# Altium schematic sheet FPGA Board Top.SchDoc
size C; SheetNumber: 1; SheetTotal: 5
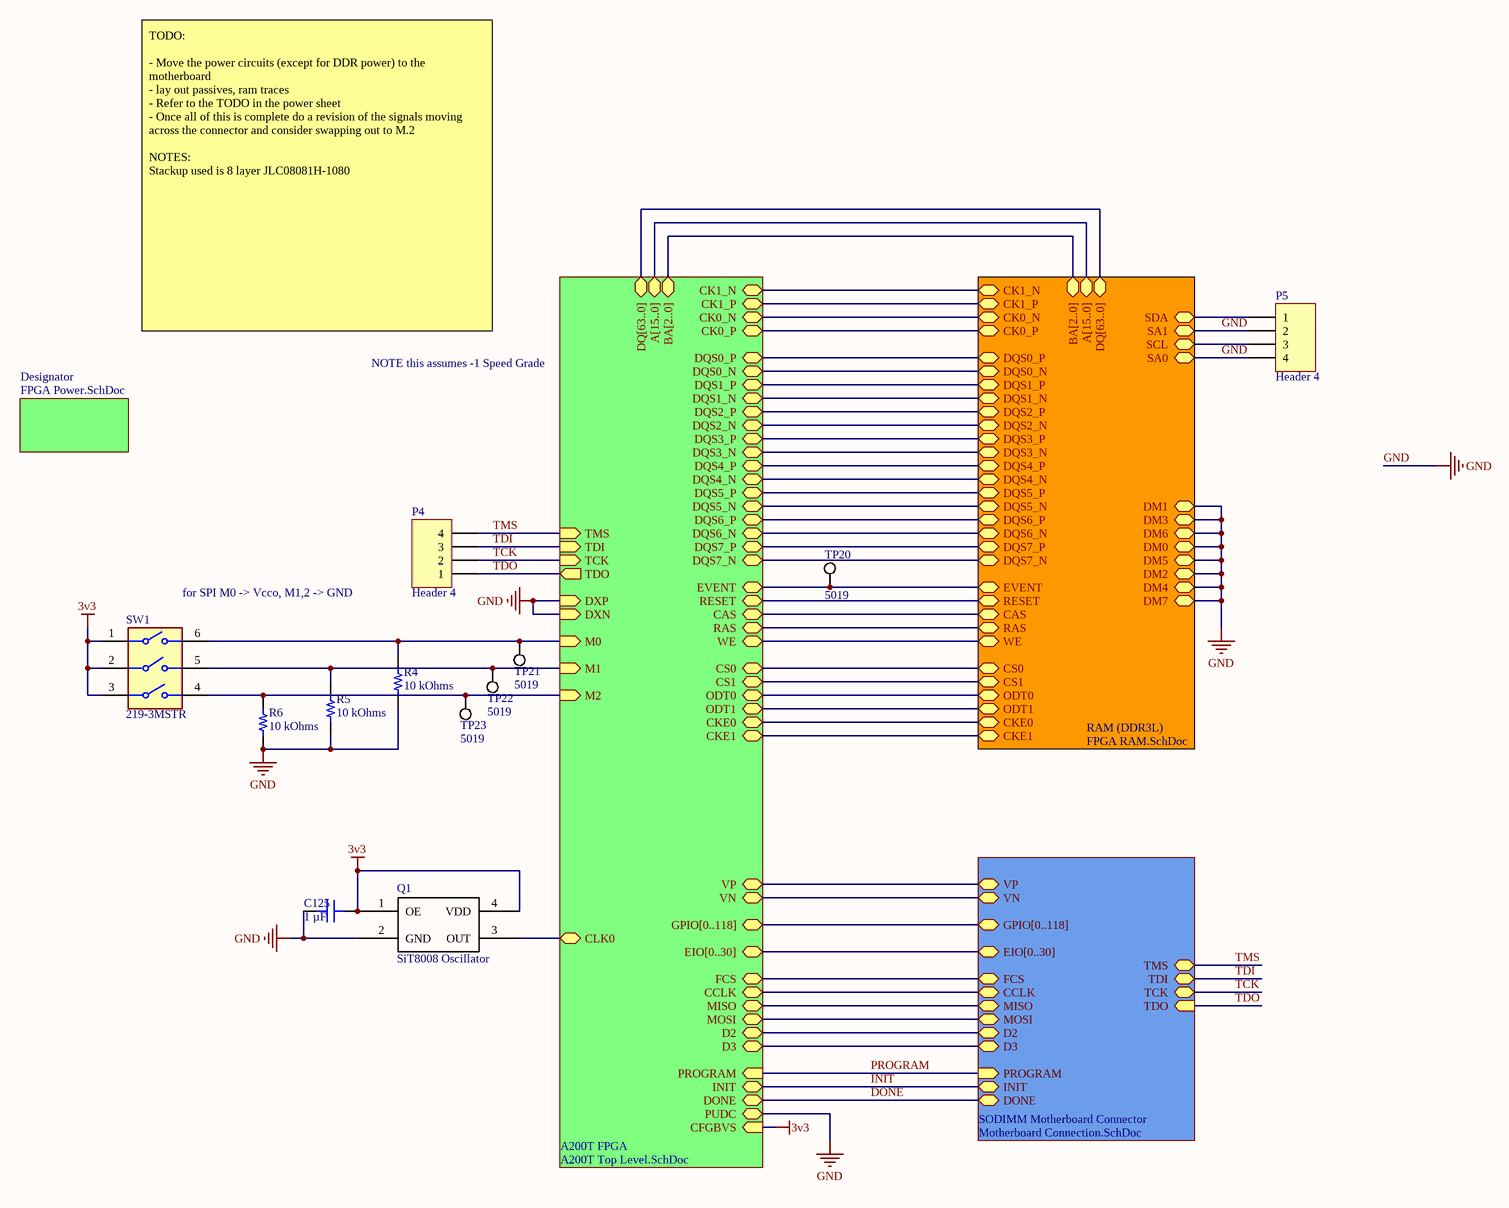
[diagram p0: FPGA Board Top.SchDoc]

## Parts
C125  1 µF  [CAP 0603_1608]
P4  Header 4  [HDR1X4]
P5  Header 4  [HDR1X4]
Q1  SiT8008 Oscillator  [SiT8008 2.5x2]
R4  10 kOhms  [RES 0603_1608]
R5  10 kOhms  [RES 0603_1608]
R6  10 kOhms  [RES 0603_1608]
SW1  219-3MSTR  [FP-219-3MSTR-MFG]
TP20  5019  [KSTN-5019_V]
TP21  5019  [KSTN-5019_V]
TP22  5019  [KSTN-5019_V]
TP23  5019  [KSTN-5019_V]

## Sub-sheets
A200T FPGA = A200T Top Level.SchDoc: BA[2..0] (bidir), A[15..0] (bidir), DQS1_P (bidir), DQS2_N (bidir), DQS7_N (bidir), DQS0_P (bidir), DQS6_N (bidir), DQS6_P (bidir), DQS1_N (bidir), DQS7_P (bidir), DQS4_P (bidir), DQS5_N (bidir), DQS3_P (bidir), DQS0_N (bidir), DQS2_P (bidir), DQS3_N (bidir), DQS4_N (bidir), DQS5_P (bidir), RAS (bidir), RESET (bidir), WE (bidir), CAS (bidir), CK0_P (bidir), CK0_N (bidir), ODT0 (bidir), CS0 (bidir), CKE0 (bidir), DQ[63..0] (bidir), PUDC (bidir), FCS (bidir), CCLK (bidir), INIT (bidir), MISO (bidir), DONE (bidir), MOSI (bidir), D2 (bidir), D3 (bidir), CLK0 (bidir), VP (bidir), VN (bidir), EIO[0..30] (bidir), GPIO[0..118] (bidir), TDO (out), CFGBVS (in), TMS (in), TCK (in), PROGRAM (in), TDI (in), DXP (in), M2 (in), M0 (in), DXN (in), M1 (in), CKE1 (bidir), CS1 (bidir), ODT1 (bidir), CK1_P (bidir), CK1_N (bidir), EVENT (bidir)
Designator = FPGA Power.SchDoc: no entries
RAM (DDR3L) = FPGA RAM.SchDoc: DQS0_P (bidir), DQS6_N (bidir), DQS7_P (bidir), DQS1_P (bidir), DQS7_N (bidir), DQS3_P (bidir), DQS1_N (bidir), DQS4_N (bidir), DQS2_P (bidir), DQS5_P (bidir), DQS3_N (bidir), DQS4_P (bidir), DQS5_N (bidir), DQS2_N (bidir), DQS0_N (bidir), DQS6_P (bidir), SDA (bidir), SA1 (bidir), SCL (bidir), SA0 (bidir), BA[2..0] (bidir), A[15..0] (bidir), CK0_N (bidir), CK0_P (bidir), RESET (bidir), CAS (bidir), RAS (bidir), WE (bidir), CS0 (bidir), ODT0 (bidir), CKE0 (bidir), DQ[63..0] (bidir), DM1 (bidir), DM3 (bidir), DM6 (bidir), DM0 (bidir), DM5 (bidir), DM2 (bidir), DM4 (bidir), DM7 (bidir), ODT1 (bidir), CK1_N (bidir), CK1_P (bidir), CS1 (bidir), CKE1 (bidir), EVENT (bidir)
SODIMM Motherboard Connector = Motherboard Connection.SchDoc: TDO (in), TMS (bidir), TCK (bidir), TDI (bidir), MOSI (bidir), D2 (bidir), MISO (bidir), FCS (bidir), D3 (bidir), CCLK (bidir), VP (bidir), VN (bidir), GPIO[0..118] (bidir), EIO[0..30] (bidir), PROGRAM (in), INIT (bidir), DONE (bidir)

## Nets
3v3: C125.2 Q1.1(OE) Q1.4(VDD) SW1.1 SW1.2 SW1.3 ; sheet A200T FPGA/CFGBVS
GND: C125.1 P5.2 P5.4 Q1.2(GND) R4.1 R5.1 R6.1 ; sheet A200T FPGA/PUDC, sheet A200T FPGA/DXP, sheet A200T FPGA/DXN, sheet RAM (DDR3L)/SA1, sheet RAM (DDR3L)/SA0, sheet RAM (DDR3L)/DM1, sheet RAM (DDR3L)/DM3, sheet RAM (DDR3L)/DM6, sheet RAM (DDR3L)/DM0, sheet RAM (DDR3L)/DM5, sheet RAM (DDR3L)/DM2, sheet RAM (DDR3L)/DM4, sheet RAM (DDR3L)/DM7
DONE: sheet A200T FPGA/DONE, sheet SODIMM Motherboard Connector/DONE
INIT: sheet A200T FPGA/INIT, sheet SODIMM Motherboard Connector/INIT
PROGRAM: sheet A200T FPGA/PROGRAM, sheet SODIMM Motherboard Connector/PROGRAM
TCK: P4.2 ; sheet A200T FPGA/TCK, sheet SODIMM Motherboard Connector/TCK
TDI: P4.3 ; sheet A200T FPGA/TDI, sheet SODIMM Motherboard Connector/TDI
TDO: P4.1 ; sheet A200T FPGA/TDO, sheet SODIMM Motherboard Connector/TDO
TMS: P4.4 ; sheet A200T FPGA/TMS, sheet SODIMM Motherboard Connector/TMS
NetP5_1: P5.1 ; sheet RAM (DDR3L)/SDA
NetP5_3: P5.3 ; sheet RAM (DDR3L)/SCL
NetQ1_3: Q1.3(OUT) ; sheet A200T FPGA/CLK0
NetR4_2: R4.2 SW1.6 TP21.1 ; sheet A200T FPGA/M0
NetR5_2: R5.2 SW1.5 TP22.1 ; sheet A200T FPGA/M1
NetR6_2: R6.2 SW1.4 TP23.1 ; sheet A200T FPGA/M2
NetTP20_1: TP20.1 ; sheet A200T FPGA/EVENT, sheet RAM (DDR3L)/EVENT
(unnamed): sheet A200T FPGA/DQS1_P, sheet RAM (DDR3L)/DQS1_P
(unnamed): sheet A200T FPGA/DQS2_N, sheet RAM (DDR3L)/DQS2_N
(unnamed): sheet A200T FPGA/DQS7_N, sheet RAM (DDR3L)/DQS7_N
(unnamed): sheet A200T FPGA/DQS0_P, sheet RAM (DDR3L)/DQS0_P
(unnamed): sheet A200T FPGA/DQS6_N, sheet RAM (DDR3L)/DQS6_N
(unnamed): sheet A200T FPGA/DQS6_P, sheet RAM (DDR3L)/DQS6_P
(unnamed): sheet A200T FPGA/DQS1_N, sheet RAM (DDR3L)/DQS1_N
(unnamed): sheet A200T FPGA/DQS7_P, sheet RAM (DDR3L)/DQS7_P
(unnamed): sheet A200T FPGA/DQS4_P, sheet RAM (DDR3L)/DQS4_P
(unnamed): sheet A200T FPGA/DQS5_N, sheet RAM (DDR3L)/DQS5_N
(unnamed): sheet A200T FPGA/DQS3_P, sheet RAM (DDR3L)/DQS3_P
(unnamed): sheet A200T FPGA/DQS0_N, sheet RAM (DDR3L)/DQS0_N
(unnamed): sheet A200T FPGA/DQS2_P, sheet RAM (DDR3L)/DQS2_P
(unnamed): sheet A200T FPGA/DQS3_N, sheet RAM (DDR3L)/DQS3_N
(unnamed): sheet A200T FPGA/DQS4_N, sheet RAM (DDR3L)/DQS4_N
(unnamed): sheet A200T FPGA/DQS5_P, sheet RAM (DDR3L)/DQS5_P
(unnamed): sheet A200T FPGA/RAS, sheet RAM (DDR3L)/RAS
(unnamed): sheet A200T FPGA/RESET, sheet RAM (DDR3L)/RESET
(unnamed): sheet A200T FPGA/WE, sheet RAM (DDR3L)/WE
(unnamed): sheet A200T FPGA/CAS, sheet RAM (DDR3L)/CAS
(unnamed): sheet A200T FPGA/CK0_P, sheet RAM (DDR3L)/CK0_P
(unnamed): sheet A200T FPGA/CK0_N, sheet RAM (DDR3L)/CK0_N
(unnamed): sheet A200T FPGA/ODT0, sheet RAM (DDR3L)/ODT0
(unnamed): sheet A200T FPGA/CS0, sheet RAM (DDR3L)/CS0
(unnamed): sheet A200T FPGA/CKE0, sheet RAM (DDR3L)/CKE0
(unnamed): sheet A200T FPGA/FCS, sheet SODIMM Motherboard Connector/FCS
(unnamed): sheet A200T FPGA/CCLK, sheet SODIMM Motherboard Connector/CCLK
(unnamed): sheet A200T FPGA/MISO, sheet SODIMM Motherboard Connector/MISO
(unnamed): sheet A200T FPGA/MOSI, sheet SODIMM Motherboard Connector/MOSI
(unnamed): sheet A200T FPGA/D2, sheet SODIMM Motherboard Connector/D2
(unnamed): sheet A200T FPGA/D3, sheet SODIMM Motherboard Connector/D3
(unnamed): sheet A200T FPGA/VP, sheet SODIMM Motherboard Connector/VP
(unnamed): sheet A200T FPGA/VN, sheet SODIMM Motherboard Connector/VN
(unnamed): sheet A200T FPGA/CKE1, sheet RAM (DDR3L)/CKE1
(unnamed): sheet A200T FPGA/CS1, sheet RAM (DDR3L)/CS1
(unnamed): sheet A200T FPGA/ODT1, sheet RAM (DDR3L)/ODT1
(unnamed): sheet A200T FPGA/CK1_P, sheet RAM (DDR3L)/CK1_P
(unnamed): sheet A200T FPGA/CK1_N, sheet RAM (DDR3L)/CK1_N

## Buses and harness runs
bus sheet A200T FPGA/A[15..0] = sheet RAM (DDR3L)/A[15..0]
bus sheet A200T FPGA/BA[2..0] = sheet RAM (DDR3L)/BA[2..0]
bus sheet A200T FPGA/DQ[63..0] = sheet RAM (DDR3L)/DQ[63..0]
bus sheet A200T FPGA/EIO[0..30] = sheet SODIMM Motherboard Connector/EIO[0..30]
bus sheet A200T FPGA/GPIO[0..118] = sheet SODIMM Motherboard Connector/GPIO[0..118]

## Notes on the sheet
- TODO:
  - Move the power circuits (except for DDR power) to the motherboard
  - lay out passives, ram traces
  - Refer to the TODO in the power sheet
  - Once all of this is complete do a revision of the signals moving across the connector and consider swapping out to M.2
  NOTES:
  Stackup used is 8 layer JLC08081H-1080
- NOTE this assumes -1 Speed Grade
- (near SW1) for SPI M0 -> Vcco, M1,2 -> GND

## Library data of the parts
C125 = CL10A105KA8NNNC: CAP CER 1UF 25V X5R 0603; manufacturer: Samsung Electro-Mechanics; Tolerance: ±10%; Part Number: CL10A105KA8NNNC; Value: 1 µF; Applications: General Purpose; Capacitance: 1 µF; componentlink1description: Datasheet; componentlink1url: http://www.samsungsem.com/kr/support/product-search/mlcc/CL10A105KA8NNNC.jsp; componentlink2description: DigiKey Link; componentlink2url: https://www.digikey.com/en/products/detail/samsung-electro-mechanics/CL10A105KA8NNNC/3886760; Device Package: 0603 (1608 Metric); lastupdated: 2023-09-26 7:09:21 PM; Lifecycle Status: Active; Minimum Order: 1; Mounting Type: Surface Mount, MLCC; Operating Temperature: -55°C ~ 85°C; Package / Case: 0603 (1608 Metric); packaging: TapeAndReel; partid: 5508; Part Status: Active; price: 0.01; series: CL; Size / Dimension: 0.063" L x 0.031" W (1.60mm x 0.80mm); Supplier 1: DigiKey; Supplier Part Number 1: 1276-1102-1-ND; Temperature Coefficient: X5R; Thickness (Max): 0.035" (0.90mm); Voltage - Rated: 25V
P4 P5 = Header 4: Header, 4-Pin; LatestRevisionDate: 17-Jul-2002; LatestRevisionNote: Re-released for DXP Platform.; Publisher: Altium Limited
R4-R6 = RC0603FR-0710KL: RES 10K OHM 1% 1/10W 0603; Manufacturer: Yageo; Power (Watts): 0.1W, 1/10W; Temperature Coefficient: ±100ppm/°C; Part Number: RC0603FR-0710KL; Value: 10 kOhms; ComponentLink1Description: Datasheet; ComponentLink1URL: https://www.yageo.com/upload/media/product/productsearch/datasheet/rchip/PYu-RC_Group_51_RoHS_L_10.pdf; ComponentLink2Description: DigiKey Link; ComponentLink2URL: https://www.digikey.com/en/products/detail/yageo/RC0603FR-0710KL/726880; Composition: Thick Film; Device Package: 0603 (1608 Metric); Features: Moisture Resistant; Height - Seated (Max): 0.022" (0.55mm); LastUpdated: 2023-09-26 7:35:55 PM; Lifecycle Status: Active; Minimum Order: 1; Number of Terminations: 2; Operating Temperature: -55°C ~ 155°C; Package / Case: 0603 (1608 Metric); Packaging: CutTape; PartId: 22599; Part Status: Active; Price: 0.01; Resistance: 10 kOhms; Series: RC_L; Size / Dimension: 0.063" L x 0.031" W (1.60mm x 0.80mm); Supplier 1: DigiKey; Supplier Part Number 1: 311-10.0KHRCT-ND; Supplier Device Package: 0603; Tolerance: ±1%
SW1 = CMP-07018-000004-1: SWITCH SLIDE DIP SPST 100MA 20V; Washable: Yes; Mechanical Life: 2000Cycles; Number of Positions: 3; Pitch: 0.1inch; Actuator Type: Slide (Standard); Max Operating Temperature: 85°C; Voltage Rating (DC): 20V; Termination: Gull Wing; Length: 0.358inch; Min Operating Temperature: -55°C; Orientation: Straight; Mount: Surface Mount; Package Quantity: 1000; Current Rating: 100mA; Electrical Life: 2000Cycles; Max Current Rating: 100mA; Throw Configuration: SPST; Contact Material: Copper; Packaging: Tape and Reel; Contact Plating: Gold; Lead Free: Lead Free; Max Voltage Rating (DC): 20V
TP20-TP23 = CMP-1672-00008-1: Test Point, 1 Position SMD, RoHS, Tape and Reel; ComponentLink1Description: Manufacturer URL; Package Quantity: 1000; DatasheetVersion: 03/2014; Packaging: Tape and Reel; ComponentLink2URL: http://www.keyelco.com/product-pdf.cfm?p=1357; ComponentLink1URL: http://www.keyelco.com/; Mount: Surface Mount; Contact Plating: Silver; PackageDescription: 1-Pin Surface Mount Device, Body 3.81 x 2.03 mm; Pins: 1; RoHSCompliant: True; Mounting Technology: Surface Mount; ComponentLink2Description: Datasheet; PackageReference: 5019